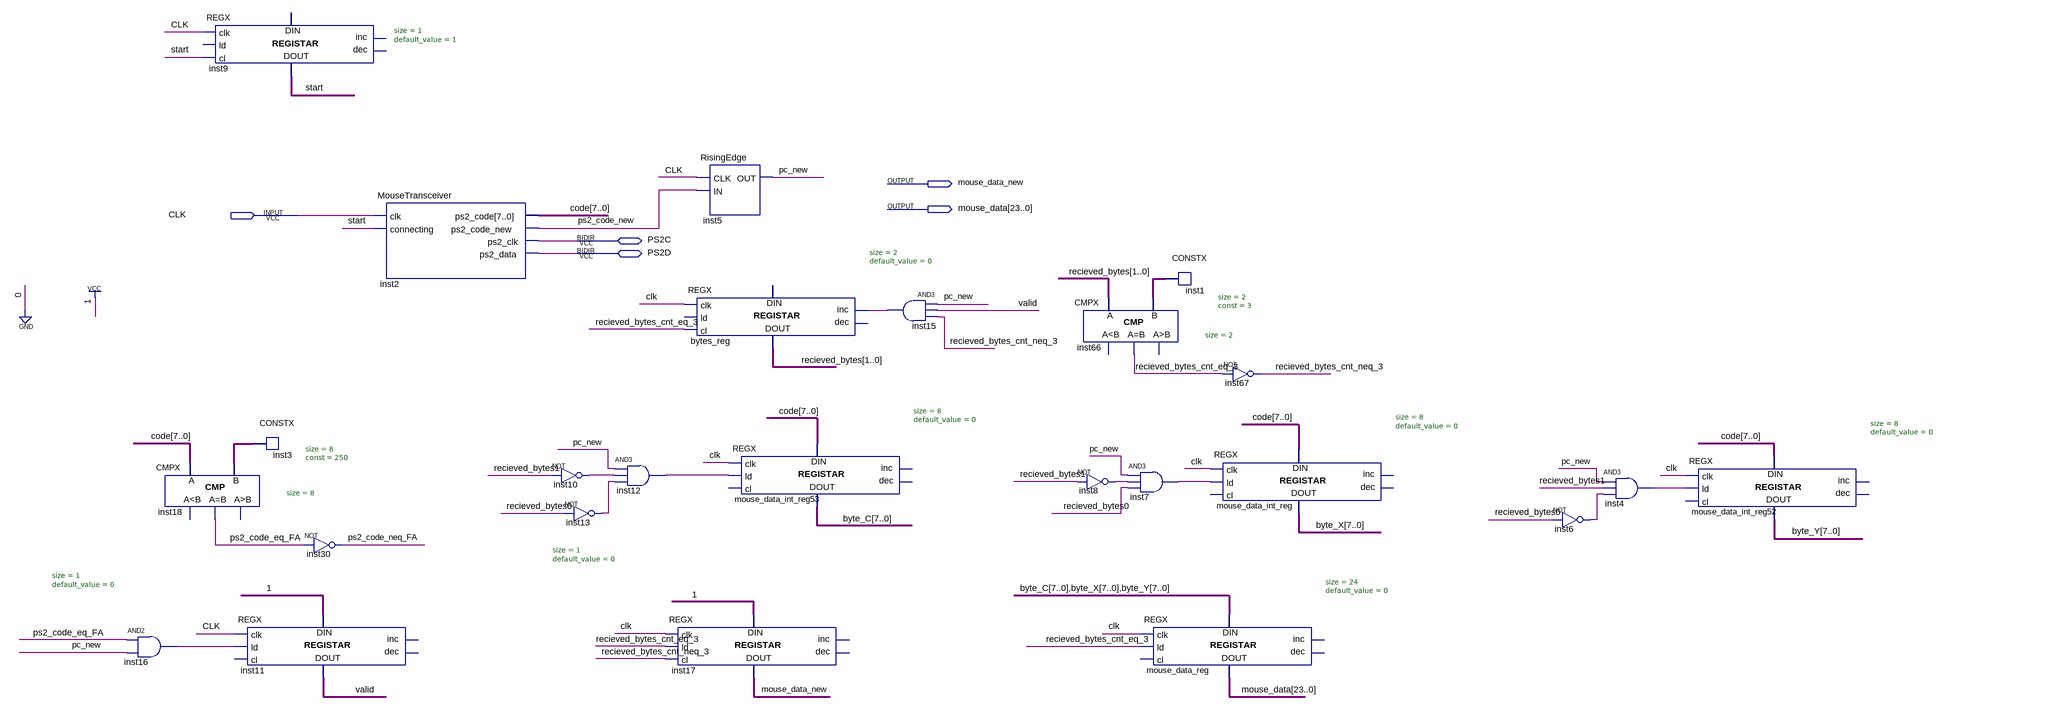
[diagram p0: schematic sheet]
// Quartus schematic MouseInterface.bdf as structural Verilog: 25 symbols, 5 pins
module MouseInterface (
  input  CLK,
  inout  PS2C,
  inout  PS2D,
  output mouse_data_new,
  output [23:0] mouse_data
);

  wire inst4_out, inst6_out, inst7_out, inst8_out, inst10_out, inst12_out, inst13_out, inst15_out,
       inst16_out, pc_new, ps2_code_eq_FA, ps2_code_neq_FA, ps2_code_new, recieved_bytes_cnt_eq_3,
       recieved_bytes_cnt_neq_3, start, valid;
  wire [1:0] inst1_data, recieved_bytes;
  wire [7:0] byte_C, byte_X, byte_Y, code, inst3_data;

  and inst16 (inst16_out, ps2_code_eq_FA, pc_new);
  CMPX #(.size(8)) inst18 (.A(code), .B(inst3_data), .eq(ps2_code_eq_FA));  // open: ls, gr
  REGX #(.size(1), .default_value(1)) inst9 (.clk(CLK), .cl(start), .data_out(start));  // open: ld, inc, dec, data_in
  REGX #(.size(1), .default_value(0)) inst11 (
    .clk(CLK), .ld(inst16_out), .data_in(1'b1), .data_out(valid));  // open: cl, inc, dec
  CONSTX #(.size(8), .\const (250)) inst3 (.data(inst3_data));
  not inst30 (ps2_code_neq_FA, ps2_code_eq_FA);
  MouseTransceiver inst2 (
    .clk(CLK), .connecting(start), .ps2_code(code), .ps2_code_new(ps2_code_new), .ps2_clk(PS2C),
    .ps2_data(PS2D));
  not inst10 (inst10_out, recieved_bytes[1]);
  not inst13 (inst13_out, recieved_bytes[0]);
  and inst12 (inst12_out, pc_new, inst10_out, inst13_out);
  RisingEdge inst5 (.CLK(CLK), .IN(ps2_code_new), .OUT(pc_new));
  REGX #(.size(2), .default_value(0)) bytes_reg (
    .clk(CLK), .cl(recieved_bytes_cnt_eq_3), .inc(inst15_out), .data_out(recieved_bytes));  // open: ld, dec, data_in
  REGX #(.size(1), .default_value(0)) inst17 (
    .clk(CLK), .ld(recieved_bytes_cnt_eq_3), .cl(recieved_bytes_cnt_neq_3), .data_in(1'b1),
    .data_out(mouse_data_new));  // open: inc, dec
  REGX #(.size(8), .default_value(0)) mouse_data_int_reg53 (
    .clk(CLK), .ld(inst12_out), .data_in(code), .data_out(byte_C));  // open: cl, inc, dec
  and inst15 (inst15_out, pc_new, valid, recieved_bytes_cnt_neq_3);
  CMPX #(.size(2)) inst66 (.A(recieved_bytes), .B(inst1_data), .eq(recieved_bytes_cnt_eq_3));  // open: ls, gr
  not inst8 (inst8_out, recieved_bytes[1]);
  and inst7 (inst7_out, pc_new, inst8_out, recieved_bytes[0]);
  REGX #(.size(24), .default_value(0)) mouse_data_reg (
    .clk(CLK), .ld(recieved_bytes_cnt_eq_3), .data_in({byte_C, byte_X, byte_Y}), .data_out(mouse_data));  // open: cl, inc, dec
  CONSTX #(.size(2), .\const (3)) inst1 (.data(inst1_data));
  REGX #(.size(8), .default_value(0)) mouse_data_int_reg (
    .clk(CLK), .ld(inst7_out), .data_in(code), .data_out(byte_X));  // open: cl, inc, dec
  not inst67 (recieved_bytes_cnt_neq_3, recieved_bytes_cnt_eq_3);
  not inst6 (inst6_out, recieved_bytes[0]);
  and inst4 (inst4_out, pc_new, recieved_bytes[1], inst6_out);
  REGX #(.size(8), .default_value(0)) mouse_data_int_reg52 (
    .clk(CLK), .ld(inst4_out), .data_in(code), .data_out(byte_Y));  // open: cl, inc, dec
endmodule
